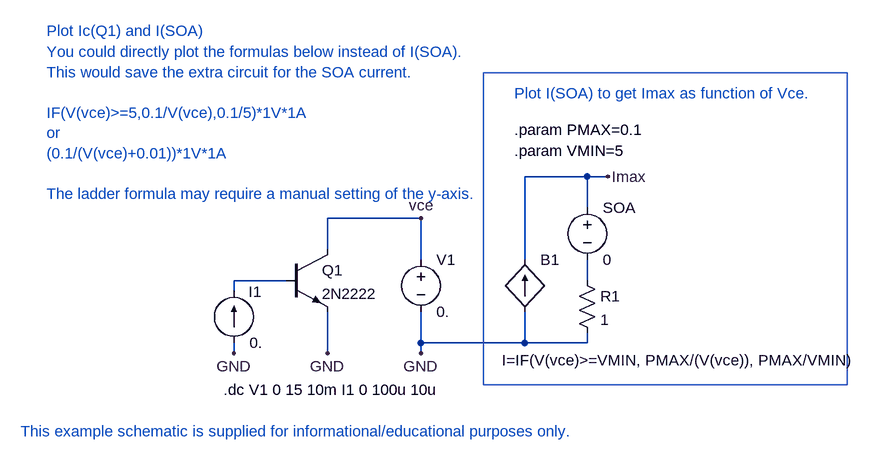
[diagram p0: schematic curvetrace_soa.asc]
curvetrace_soa.asc, the LTspice schematic file:
Version 4
SHEET 1 3052 1528
WIRE 1840 1264 1840 1248
WIRE 1840 1360 1840 1344
WIRE 1920 1248 1840 1248
WIRE 1984 1200 1984 1152
WIRE 1984 1360 1984 1296
WIRE 2128 1152 1984 1152
WIRE 2128 1216 2128 1152
WIRE 2128 1344 2128 1296
WIRE 2128 1360 2128 1344
WIRE 2288 1216 2288 1088
WIRE 2288 1344 2128 1344
WIRE 2288 1344 2288 1296
WIRE 2384 1088 2288 1088
WIRE 2384 1136 2384 1088
WIRE 2384 1248 2384 1216
WIRE 2384 1344 2288 1344
WIRE 2384 1344 2384 1328
WIRE 2416 1088 2384 1088
FLAG 2128 1360 GND
FLAG 1984 1360 GND
FLAG 1840 1360 GND
FLAG 2128 1152 vce
FLAG 2416 1088 Imax
SYMBOL npn 1920 1200 R0
SYMATTR InstName Q1
SYMATTR Value 2N2222
SYMBOL voltage 2128 1200 R0
SYMATTR InstName V1
SYMATTR Value 0.
SYMBOL current 1840 1344 M180
WINDOW 0 23 79 Left 0
WINDOW 3 24 0 Left 0
SYMATTR InstName I1
SYMATTR Value 0.
SYMBOL res 2368 1232 R0
SYMATTR InstName R1
SYMATTR Value 1
SYMBOL bi2 2288 1216 R0
WINDOW 3 -35 155 Left 0
SYMATTR InstName B1
SYMATTR Value I=IF(V(vce)>=VMIN, PMAX/(V(vce)), PMAX/VMIN)
SYMBOL voltage 2384 1120 R0
SYMATTR InstName SOA
SYMATTR Value 0
TEXT 1824 1416 Left 0 !.dc V1 0 15 10m I1 0 100u 10u
TEXT 1512 1480 Left 0 ;This example schematic is supplied for informational/educational purposes only.
TEXT 2272 1016 Left 0 !.param PMAX=0.1
TEXT 2272 1048 Left 0 !.param VMIN=5
TEXT 2272 960 Left 0 ;Plot I(SOA) to get Imax as function of Vce.
TEXT 1552 864 Left 0 ;Plot Ic(Q1) and I(SOA)
TEXT 1552 896 Left 0 ;You could directly plot the formulas below instead of I(SOA).\nThis would save the extra circuit for the SOA current.\n \nIF(V(vce)>=5,0.1/V(vce),0.1/5)*1V*1A\nor\n(0.1/(V(vce)+0.01))*1V*1A\n \nThe ladder formula may require a manual setting of the y-axis.
RECTANGLE Normal 2784 1408 2224 928

The netlist it stands for:
* curvetrace_soa.asc
Q1 vce N001 GND 0 2N2222
V1 vce GND 0.
I1 GND N001 0.
R1 N002 GND 1
B1 GND Imax I=IF(V(vce)>=VMIN, PMAX/(V(vce)), PMAX/VMIN)
V§SOA Imax N002 0
.model NPN NPN
.model PNP PNP
.lib standard.bjt
.dc V1 0 15 10m I1 0 100u 10u
* This example schematic is supplied for informational/educational purposes only.
.param PMAX=0.1
.param VMIN=5
* Plot I(SOA) to get Imax as function of Vce.
* Plot Ic(Q1) and I(SOA)
* You could directly plot the formulas below instead of I(SOA).
* This would save the extra circuit for the SOA current.
* IF(V(vce)>=5,0.1/V(vce),0.1/5)*1V*1A
* or
* (0.1/(V(vce)+0.01))*1V*1A
* The ladder formula may require a manual setting of the y-axis.
.backanno
.end